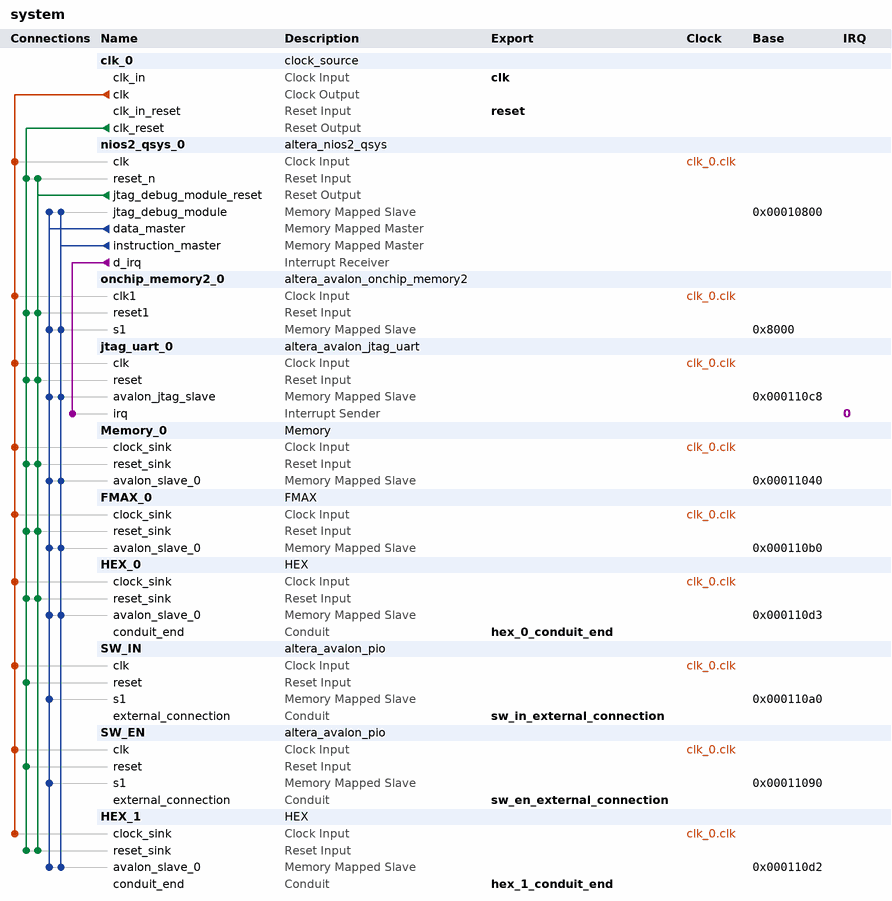
[diagram p0: system contents]
# Platform Designer (Qsys) system system, Cyclone II EP2C35F672C6
# Parameters at their usual value, and those the tool derives, are not listed.
package require -exact qsys 13.0.1.99.2
create_system system
set_project_property DEVICE_FAMILY {Cyclone II}
set_project_property DEVICE EP2C35F672C6

add_instance clk_0 clock_source 13.0
set_instance_parameter_value clk_0 clockFrequency 50000000

add_instance nios2_qsys_0 altera_nios2_qsys 13.0
set_instance_parameter_value nios2_qsys_0 resetSlave onchip_memory2_0.s1
set_instance_parameter_value nios2_qsys_0 mmu_TLBMissExcSlave None
set_instance_parameter_value nios2_qsys_0 exceptionSlave onchip_memory2_0.s1
set_instance_parameter_value nios2_qsys_0 breakSlave nios2_qsys_0.jtag_debug_module
set_instance_parameter_value nios2_qsys_0 impl Tiny
set_instance_parameter_value nios2_qsys_0 icache_size 4096

add_instance onchip_memory2_0 altera_avalon_onchip_memory2 13.0.1.99.2
set_instance_parameter_value onchip_memory2_0 dataWidth 32
set_instance_parameter_value onchip_memory2_0 dualPort false
set_instance_parameter_value onchip_memory2_0 initMemContent true
set_instance_parameter_value onchip_memory2_0 initializationFileName onchip_mem.hex
set_instance_parameter_value onchip_memory2_0 memorySize 32768

add_instance jtag_uart_0 altera_avalon_jtag_uart 13.0.1.99.2
set_instance_parameter_value jtag_uart_0 simInteractiveOptions NO_INTERACTIVE_WINDOWS

add_instance Memory_0 Memory 1.0
set_instance_parameter_value Memory_0 DATA_WIDTH 32
set_instance_parameter_value Memory_0 ADDRESS_WIDTH 4

add_instance FMAX_0 FMAX 1.0

add_instance HEX_0 HEX 1.0

add_instance SW_IN altera_avalon_pio 13.0.1.99.2
set_instance_parameter_value SW_IN direction Input
set_instance_parameter_value SW_IN width 4

add_instance SW_EN altera_avalon_pio 13.0.1.99.2
set_instance_parameter_value SW_EN direction Input
set_instance_parameter_value SW_EN width 1

add_instance HEX_1 HEX 1.0

# connections
add_connection clk_0.clk FMAX_0.clock_sink clock
add_connection clk_0.clk HEX_0.clock_sink clock
add_connection clk_0.clk HEX_1.clock_sink clock
add_connection clk_0.clk jtag_uart_0.clk clock
add_connection clk_0.clk Memory_0.clock_sink clock
add_connection clk_0.clk nios2_qsys_0.clk clock
add_connection clk_0.clk onchip_memory2_0.clk1 clock
add_connection clk_0.clk SW_EN.clk clock
add_connection clk_0.clk SW_IN.clk clock
add_connection clk_0.clk_reset FMAX_0.reset_sink reset
add_connection clk_0.clk_reset HEX_0.reset_sink reset
add_connection clk_0.clk_reset HEX_1.reset_sink reset
add_connection clk_0.clk_reset jtag_uart_0.reset reset
add_connection clk_0.clk_reset Memory_0.reset_sink reset
add_connection clk_0.clk_reset nios2_qsys_0.reset_n reset
add_connection clk_0.clk_reset onchip_memory2_0.reset1 reset
add_connection clk_0.clk_reset SW_EN.reset reset
add_connection clk_0.clk_reset SW_IN.reset reset
add_connection nios2_qsys_0.jtag_debug_module_reset FMAX_0.reset_sink reset
add_connection nios2_qsys_0.jtag_debug_module_reset HEX_0.reset_sink reset
add_connection nios2_qsys_0.jtag_debug_module_reset HEX_1.reset_sink reset
add_connection nios2_qsys_0.jtag_debug_module_reset jtag_uart_0.reset reset
add_connection nios2_qsys_0.jtag_debug_module_reset Memory_0.reset_sink reset
add_connection nios2_qsys_0.jtag_debug_module_reset nios2_qsys_0.reset_n reset
add_connection nios2_qsys_0.jtag_debug_module_reset onchip_memory2_0.reset1 reset
add_connection nios2_qsys_0.data_master FMAX_0.avalon_slave_0 avalon
set_connection_parameter_value nios2_qsys_0.data_master/FMAX_0.avalon_slave_0 baseAddress 0x000110b0
add_connection nios2_qsys_0.data_master HEX_0.avalon_slave_0 avalon
set_connection_parameter_value nios2_qsys_0.data_master/HEX_0.avalon_slave_0 baseAddress 0x000110d3
add_connection nios2_qsys_0.data_master HEX_1.avalon_slave_0 avalon
set_connection_parameter_value nios2_qsys_0.data_master/HEX_1.avalon_slave_0 baseAddress 0x000110d2
add_connection nios2_qsys_0.data_master jtag_uart_0.avalon_jtag_slave avalon
set_connection_parameter_value nios2_qsys_0.data_master/jtag_uart_0.avalon_jtag_slave baseAddress 0x000110c8
add_connection nios2_qsys_0.data_master Memory_0.avalon_slave_0 avalon
set_connection_parameter_value nios2_qsys_0.data_master/Memory_0.avalon_slave_0 baseAddress 0x00011040
add_connection nios2_qsys_0.data_master nios2_qsys_0.jtag_debug_module avalon
set_connection_parameter_value nios2_qsys_0.data_master/nios2_qsys_0.jtag_debug_module baseAddress 0x00010800
add_connection nios2_qsys_0.data_master onchip_memory2_0.s1 avalon
set_connection_parameter_value nios2_qsys_0.data_master/onchip_memory2_0.s1 baseAddress 0x8000
add_connection nios2_qsys_0.data_master SW_EN.s1 avalon
set_connection_parameter_value nios2_qsys_0.data_master/SW_EN.s1 baseAddress 0x00011090
add_connection nios2_qsys_0.data_master SW_IN.s1 avalon
set_connection_parameter_value nios2_qsys_0.data_master/SW_IN.s1 baseAddress 0x000110a0
add_connection nios2_qsys_0.instruction_master FMAX_0.avalon_slave_0 avalon
set_connection_parameter_value nios2_qsys_0.instruction_master/FMAX_0.avalon_slave_0 baseAddress 0x000110b0
add_connection nios2_qsys_0.instruction_master HEX_0.avalon_slave_0 avalon
set_connection_parameter_value nios2_qsys_0.instruction_master/HEX_0.avalon_slave_0 baseAddress 0x000110d3
add_connection nios2_qsys_0.instruction_master HEX_1.avalon_slave_0 avalon
set_connection_parameter_value nios2_qsys_0.instruction_master/HEX_1.avalon_slave_0 baseAddress 0x000110d2
add_connection nios2_qsys_0.instruction_master jtag_uart_0.avalon_jtag_slave avalon
set_connection_parameter_value nios2_qsys_0.instruction_master/jtag_uart_0.avalon_jtag_slave baseAddress 0x000110c8
add_connection nios2_qsys_0.instruction_master Memory_0.avalon_slave_0 avalon
set_connection_parameter_value nios2_qsys_0.instruction_master/Memory_0.avalon_slave_0 baseAddress 0x00011040
add_connection nios2_qsys_0.instruction_master nios2_qsys_0.jtag_debug_module avalon
set_connection_parameter_value nios2_qsys_0.instruction_master/nios2_qsys_0.jtag_debug_module baseAddress 0x00010800
add_connection nios2_qsys_0.instruction_master onchip_memory2_0.s1 avalon
set_connection_parameter_value nios2_qsys_0.instruction_master/onchip_memory2_0.s1 baseAddress 0x8000
add_connection nios2_qsys_0.d_irq jtag_uart_0.irq interrupt
set_connection_parameter_value nios2_qsys_0.d_irq/jtag_uart_0.irq irqNumber 0

# exported interfaces
add_interface clk clock sink
set_interface_property clk EXPORT_OF clk_0.clk_in
add_interface reset reset sink
set_interface_property reset EXPORT_OF clk_0.clk_in_reset
add_interface sw_in_external_connection conduit end
set_interface_property sw_in_external_connection EXPORT_OF SW_IN.external_connection
add_interface sw_en_external_connection conduit end
set_interface_property sw_en_external_connection EXPORT_OF SW_EN.external_connection
add_interface hex_0_conduit_end conduit end
set_interface_property hex_0_conduit_end EXPORT_OF HEX_0.conduit_end
add_interface hex_1_conduit_end conduit end
set_interface_property hex_1_conduit_end EXPORT_OF HEX_1.conduit_end

set_interconnect_requirement {$system} qsys_mm.clockCrossingAdapter HANDSHAKE
set_interconnect_requirement {$system} qsys_mm.maxAdditionalLatency 1

save_system system.qsys
